# EAGLE design pcb (EAGLE 9.5.2)
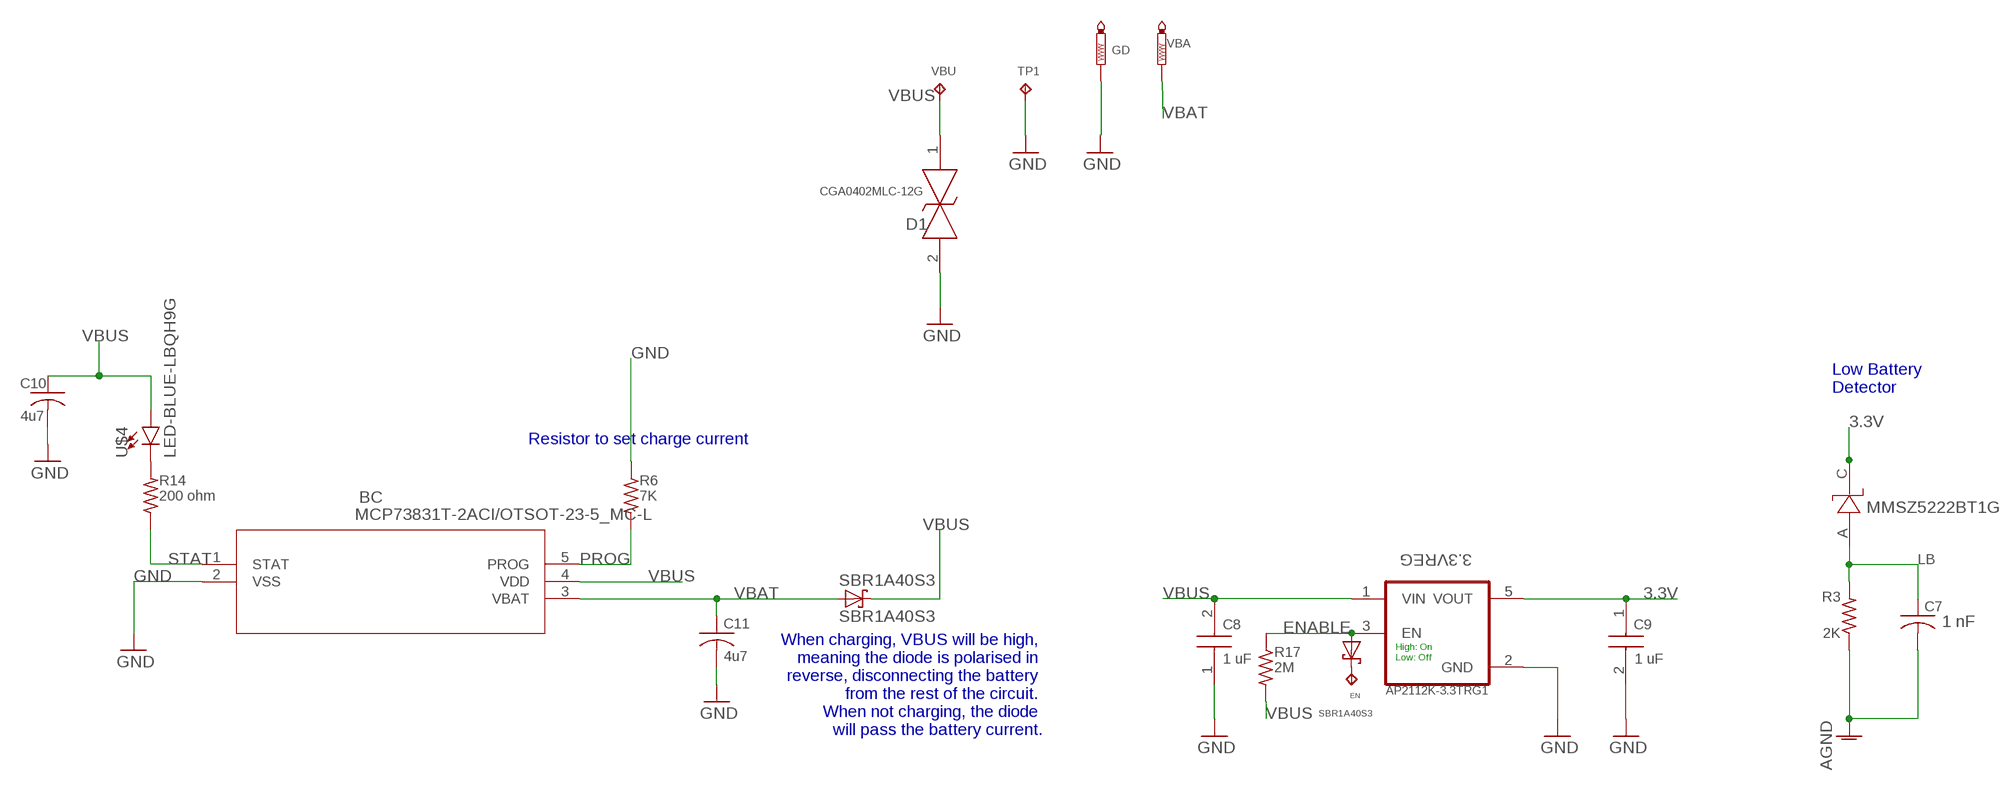
[diagram p0: schematic, sheet 1, part 1 of 2]
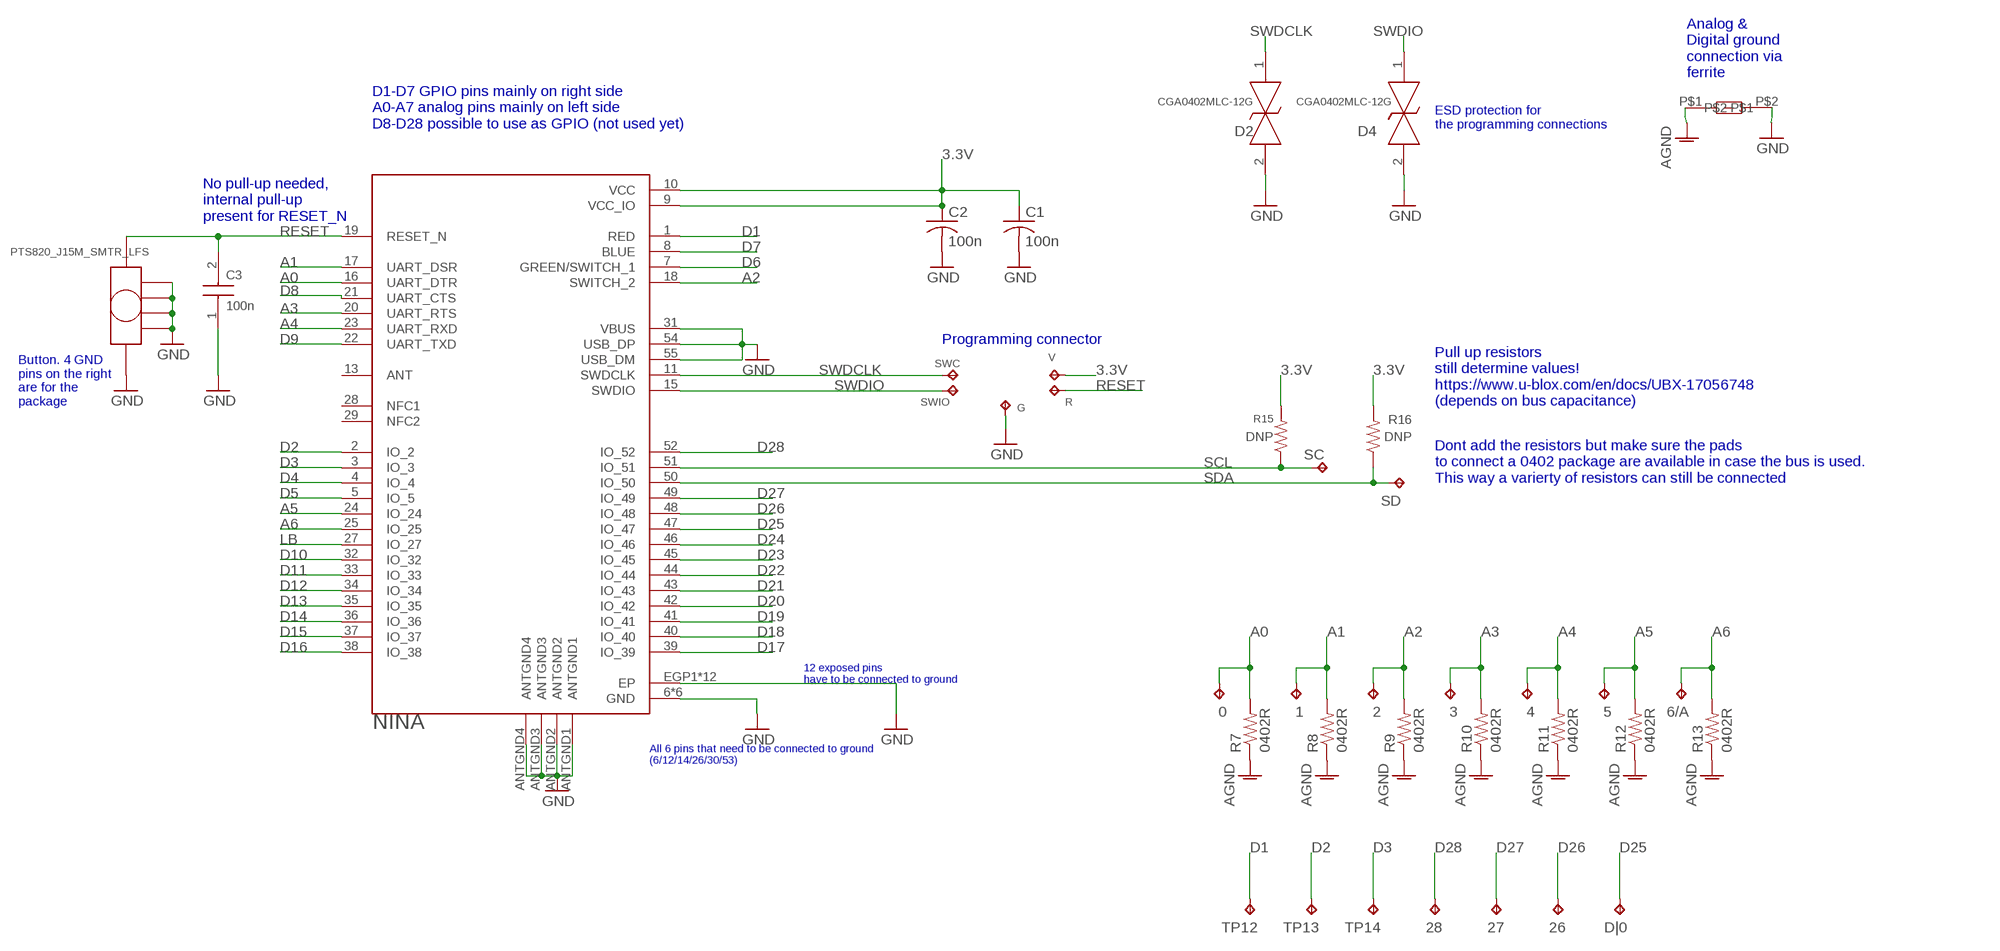
[diagram p1: schematic, sheet 1, part 2 of 2]

## Parts
0  CUSTOM_HOLE1  [CUSTOM_HOLE]
1  CUSTOM_HOLE1  [CUSTOM_HOLE]
2  CUSTOM_HOLE1  [CUSTOM_HOLE]
3  CUSTOM_HOLE1  [CUSTOM_HOLE]
3.3VREG  AP2112K-3.3TRG1  [SOT95P285X140-5N]
4  CUSTOM_HOLE1  [CUSTOM_HOLE]
5  CUSTOM_HOLE1  [CUSTOM_HOLE]
6/A  CUSTOM_HOLE1  [CUSTOM_HOLE]
26  CUSTOM_HOLE1  [CUSTOM_HOLE]
27  CUSTOM_HOLE1  [CUSTOM_HOLE]
28  CUSTOM_HOLE1  [CUSTOM_HOLE]
BC  MCP73831T-2ACI/OTSOT-23-5_MC-L  [SOT-23-5_MC-L]
BUTTON  PTS820_J15M_SMTR_LFS  [PTS820_J15]
C1  100n  C-USC0402  [C0402]
C2  100n  C-USC0402  [C0402]
C3  100n  JMK105BJ105KP-F  [CAPC1005X33N]
C7  1 nF  C-USC0402  [C0402]
C8  1 uF  JMK105BJ105KP-F  [CAPC1005X33N]
C9  1 uF  JMK105BJ105KP-F  [CAPC1005X33N]
C10  4u7  C-USC0402  [C0402]
C11  4u7  C-USC0402  [C0402]
D1  CGA0402MLC-12G  [CGA0402MLC12G]
D2  CGA0402MLC-12G  [CGA0402MLC12G]
D4  CGA0402MLC-12G  [CGA0402MLC12G]
D|0  CUSTOM_HOLE1  [CUSTOM_HOLE]
EN  CUSTOM_HOLE1  [CUSTOM_HOLE]
G  TPB1,27  [B1,27]
GD  PTR1TP18R  [TP18R]
MMSZ5222BT1G  MMSZ5222BT1G  [SOD−123]
R  TPB1,27  [B1,27]
R3  2K  0402R  [RESC1005X40N]
R6  7K  0402R  [RESC1005X40N]
R7  0402R  [RESC1005X40N]
R8  0402R  [RESC1005X40N]
R9  0402R  [RESC1005X40N]
R10  0402R  [RESC1005X40N]
R11  0402R  [RESC1005X40N]
R12  0402R  [RESC1005X40N]
R13  0402R  [RESC1005X40N]
R14  200 ohm  0402R  [RESC1005X40N]
R15  DNP  0402R  [RESC1005X40N]
R16  DNP  0402R  [RESC1005X40N]
R17  2M  0402R  [RESC1005X40N]
SBR1A40S3  SBR1A40S3  [SOD323]
SC  CUSTOM_HOLE1  [CUSTOM_HOLE]
SD  CUSTOM_HOLE1  [CUSTOM_HOLE]
SWC  TPB1,27  [B1,27]
SWIO  TPB1,27  [B1,27]
TP1  CUSTOM_HOLE1  [CUSTOM_HOLE]
TP12  CUSTOM_HOLE1  [CUSTOM_HOLE]
TP13  CUSTOM_HOLE1  [CUSTOM_HOLE]
TP14  CUSTOM_HOLE1  [CUSTOM_HOLE]
U1  NINA  NINA-B306  [XCVR_NINA-B306]
U$2  SBR1A40S3  [SOD323]
U$4  LED-BLUE-LBQH9G  [LBQH9G-0402]
U$5  BLM18KG121WH1D  [0603]
V  TPB1,27  [B1,27]
VBA  PTR1TP18R  [TP18R]
VBU  CUSTOM_HOLE1  [CUSTOM_HOLE]

## Nets
3.3V: 3.3VREG.5(VOUT) C1.1 C2.1 C9.1 MMSZ5222BT1G.C R15.2 R16.2 U1.9(VCC_IO) U1.10(VCC) V.TP
A0: 0.P$1(TP) R7.2 U1.16(UART_DTR)
A1: 1.P$1(TP) R8.2 U1.17(UART_DSR)
A2: 2.P$1(TP) R9.2 U1.18(SWITCH_2)
A3: 3.P$1(TP) R10.2 U1.20(UART_RTS)
A4: 4.P$1(TP) R11.2 U1.23(UART_RXD)
A5: 5.P$1(TP) R12.2 U1.24(IO_24)
A6: 6/A.P$1(TP) R13.2 U1.25(IO_25)
AGND: C7.2 R3.1 R7.1 R8.1 R9.1 R10.1 R11.1 R12.1 R13.1 U$5.P$1
D1: TP12.P$1(TP) U1.1(RED)
D2: TP13.P$1(TP) U1.2(IO_2)
D3: TP14.P$1(TP) U1.3(IO_3)
D4: U1.4(IO_4)
D5: U1.5(IO_5)
D6: U1.7(GREEN/SWITCH_1)
D7: U1.8(BLUE)
D8: U1.21(UART_CTS)
D9: U1.22(UART_TXD)
D10: U1.32(IO_32)
D11: U1.33(IO_33)
D12: U1.34(IO_34)
D13: U1.35(IO_35)
D14: U1.36(IO_36)
D15: U1.37(IO_37)
D16: U1.38(IO_38)
D17: U1.39(IO_39)
D18: U1.40(IO_40)
D19: U1.41(IO_41)
D20: U1.42(IO_42)
D21: U1.43(IO_43)
D22: U1.44(IO_44)
D23: U1.45(IO_45)
D24: U1.46(IO_46)
D25: D|0.P$1(TP) U1.47(IO_47)
D26: 26.P$1(TP) U1.48(IO_48)
D27: 27.P$1(TP) U1.49(IO_49)
D28: 28.P$1(TP) U1.52(IO_52)
ENABLE: 3.3VREG.3(EN) R17.1 U$2.A
GND: 3.3VREG.2(GND) BC.2(VSS) BUTTON.1 BUTTON.P$1 BUTTON.P$2 BUTTON.P$3 BUTTON.P$4 C1.2 C2.2 C3.1 C8.1 C9.2 C10.2 C11.2 D1.2 D2.2 D4.2 G.TP GD.TP R6.1 TP1.P$1(TP) U1.6(GND) U1.12(GND) U1.14(GND) U1.26(GND) U1.30(GND) U1.31(VBUS) U1.53(GND) U1.54(USB_DP) U1.55(USB_DM) U1.ANTGND1 U1.ANTGND2 U1.ANTGND3 U1.ANTGND4 U1.EGP1(EP) U1.EGP2(EP) U1.EGP3(EP) U1.EGP4(EP) U1.EGP5(EP) U1.EGP6(EP) U1.EGP7(EP) U1.EGP8(EP) U1.EGP9(EP) U1.EGP10(EP) U1.EGP11(EP) U1.EGP12(EP) U$5.P$2
LB: C7.1 MMSZ5222BT1G.A R3.2 U1.27(IO_27)
N$1: R14.2 U$4.C
N$11: EN.P$1(TP) U$2.C
PROG: BC.5(PROG) R6.2
RESET: BUTTON.2 C3.2 R.TP U1.19(RESET_N)
SCL: R15.1 SC.P$1(TP) U1.51(IO_51)
SDA: R16.1 SD.P$1(TP) U1.50(IO_50)
STAT: BC.1(STAT) R14.1
SWDCLK: D2.1 SWC.TP U1.11(SWDCLK)
SWDIO: D4.1 SWIO.TP U1.15(SWDIO)
VBAT: BC.3(VBAT) C11.1 SBR1A40S3.A VBA.TP
VBUS: 3.3VREG.1(VIN) BC.4(VDD) C8.2 C10.1 D1.1 R17.2 SBR1A40S3.C U$4.A VBU.P$1(TP)
Unconnected: U1.13(ANT) U1.28(NFC1) U1.29(NFC2)

## Notes on the sheet
- Analog & 
  Digital ground
  connection via
  ferrite
- D1-D7 GPIO pins mainly on right side
  A0-A7 analog pins mainly on left side
  D8-D28 possible to use as GPIO (not used yet)
- ESD protection for 
  the programming connections
- Low Battery
  Detector
- No pull-up needed,
  internal pull-up
  present for RESET_N
- Resistor to set charge current
- Programming connector
- Button. 4 GND
  pins on the right
  are for the
  package
- Pull up resistors
  still determine values!
  https://www.u-blox.com/en/docs/UBX-17056748
  (depends on bus capacitance)
- When charging, VBUS will be high, 
  meaning the diode is polarised in 
  reverse, disconnecting the battery 
  from the rest of the circuit. 
  When not charging, the diode 
  will pass the battery current.
- High: On
  Low: Off
- Dont add the resistors but make sure the pads 
  to connect a 0402 package are available in case the bus is used. 
  This way a varierty of resistors can still be connected
- 12 exposed pins 
  have to be connected to ground
- All 6 pins that need to be connected to ground
  (6/12/14/26/30/53)

## Library data of the parts
0 1-5 6/A 26-28 D|0 EN SC SD TP1 TP12-TP14 VBU = testpad:CUSTOM_HOLE1
3.3VREG = AP2112K-3.3TRG1:AP2112K-3.3TRG1: AP2112 Series 0.6 A 3.3 V Fixed Output SMT LDO Linear Regulator - SOT23-5; AVAILABILITY: Unavailable; DESCRIPTION: Linear Voltage Regulator IC 1 Output 600mA SOT-25; MF: Diodes Inc.; MP: AP2112K-3.3TRG1; PACKAGE: SOT-753 Diodes Inc.; PRICE: None
BC = MCP73831T-2ACI-OT_BattCharg:MCP73831T-2ACI/OT; BUILT_BY: EMA_UL_Team; MANUFACTURER_PART_NUMBER: MCP73831T-2ACI/OT; VENDOR: Microchip
BUTTON = [button]PTS820_J15M_SMTR_LFS:PTS820_J15M_SMTR_LFS: PTS 820 Series Microminiature SMT Top Actuated Source: Datasheet <http://www.ckswitches.com/media/1474/pts820.pdf>; DESCRIPTION: PTS 820 Series Microminiature SMT Top Actuated; HEIGHT: mm; MANUFACTURER_NAME: C & K COMPONENTS; MANUFACTURER_PART_NUMBER: PTS820 J15M SMTR LFS; MOUSER_PART_NUMBER: 611-PTS820J15MSMTR; MOUSER_PRICE-STOCK: https://www.mouser.com/Search/Refine.aspx?Keyword=611-PTS820J15MSMTR; RS_PART_NUMBER: 1359503P; RS_PRICE-STOCK: http://uk.rs-online.com/web/p/products/1359503P
C1 C2 C7 C10 C11 = rcl:C-US: CAPACITOR, American symbol; SPICEPREFIX: C
C3 C8 C9 = capacitor_1uF_0402:JMK105BJ105KP-F: Taiyo Yuden JMK105BJ105KP-F 1F MLCC 6.3V dc +/-10% Tolerance SMD Source: Datasheet <https://componentsearchengine.com/Datasheets/1/JMK105BJ105KP-F.pdf>; DESCRIPTION: Taiyo Yuden JMK105BJ105KP-F 1F MLCC 6.3V dc +/-10% Tolerance SMD; HEIGHT: 0.33mm; MANUFACTURER_NAME: TAIYO YUDEN; MANUFACTURER_PART_NUMBER: JMK105BJ105KP-F; MOUSER_PART_NUMBER: 963-JMK105BJ105KP-F; MOUSER_PRICE-STOCK: https://www.mouser.com/Search/Refine.aspx?Keyword=963-JMK105BJ105KP-F
D1 D2 D4 = CGA0402MLC-12G:CGA0402MLC-12G: Bourns CGA0402MLC-12G, ESD Protection Diode, 2-Pin MLC Source: Datasheet <https://componentsearchengine.com/Datasheets/1/CGA0402MLC-12G.pdf>; DESCRIPTION: Bourns CGA0402MLC-12G, ESD Protection Diode, 2-Pin MLC; HEIGHT: 0.44mm; MANUFACTURER_NAME: Bourns; MANUFACTURER_PART_NUMBER: CGA0402MLC-12G; MOUSER_PART_NUMBER: 652-CGA0402MLC-12G; MOUSER_PRICE-STOCK: https://www.mouser.com/Search/Refine.aspx?Keyword=652-CGA0402MLC-12G
G R SWC SWIO V = testpad:TP: Test pad
GD VBA = testpad:PTR1: TEST PIN
MMSZ5222BT1G = [Zener]MMSZ52xxxT1G:MMSZ5222BT1G
R3 R6-R17 = custom0402R:0402R
SBR1A40S3 U$2 = diode:SBR1A40S3
U1 = NINA-B306:NINA-B306: BLUETOOTH LOW ENERGY MODULE STAN; AVAILABILITY: Unavailable; DESCRIPTION: Bluetooth Bluetooth v5.0 Transceiver Module 2.4GHz Antenna Not Included Surface Mount; MF: U-Blox America Inc.; MP: NINA-B311-00B; PACKAGE: SMD-55 U-Blox America Inc.; PRICE: None
U$4 = SparkFun-LED:LED-BLUE-LBQH9G
U$5 = [Ferrite]:BLM18KG121WH1D

## Board
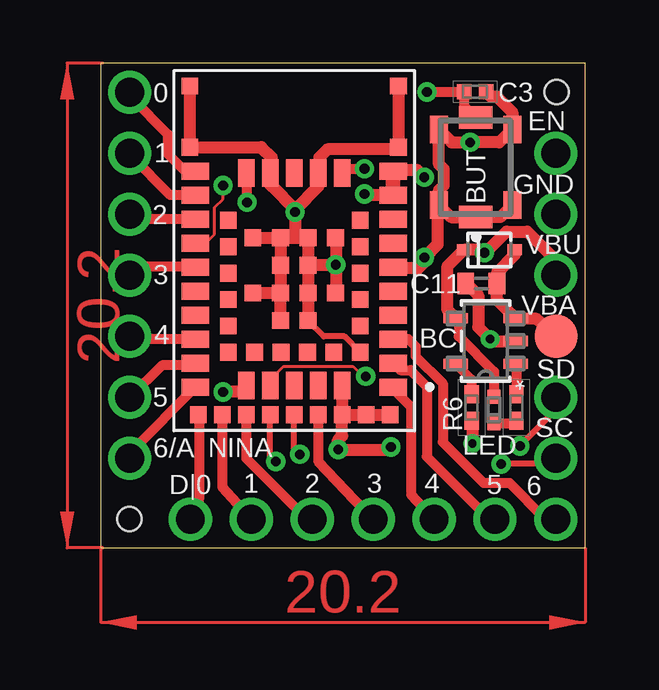
[diagram p2: board, top side]
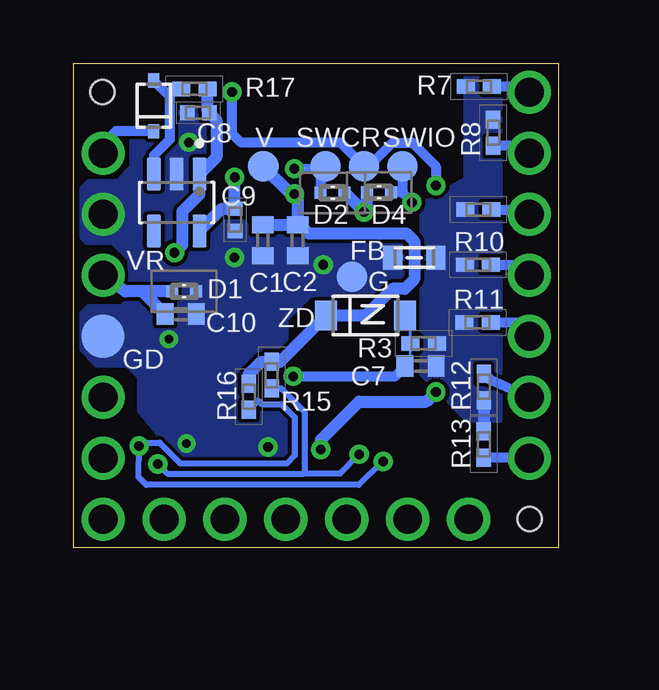
[diagram p3: board, bottom side, seen from below]

Size 20.2 x 20.2 mm. Coordinates in mm from the lower left corner, seen from the top.
Outline: 0,0 20.2,0 20.2,20.2 0,20.2 0,0
Copper layers (1*16): Top 0.035mm / dielectric 1.5mm / Bottom 0.035mm
Design rules "default *": minimum track width 3mil, minimum drill 0.35mm, track to track 6mil, track to pad 6mil, pad to pad 6mil, via to via 6mil, smd to smd 6mil, copper to edge 10mil, drill to drill 0.4mm, minimum pad ring 10mil, minimum via ring 8mil, stop-mask expansion 4mil, vias tented up to drill 0mil, thermal gap 0mil
Holes 1 mm at 1.2,1.2 19,19

### Footprints (pad centres in the part's own frame; a part is rotated, then mirrored left to right if it is on the bottom)
CUSTOM_HOLE = drill 1.2: P$1 0,0
SOT95P285X140-5N = smd 1.35 x 0.6: 1 -1.185,0.95; 2 -1.185,0; 3 -1.185,-0.95; 4 1.185,-0.95; 5 1.185,0.95
SOT-23-5_MC-L = smd 1.01 x 0.428: 1 -1.245,0.95; 2 -1.245,0; 3 -1.245,-0.95; 4 1.245,-0.95; 5 1.245,0.95
PTS820_J15 = smd 0.95 x 1.4: 1 -2.075,0; 2 2.075,0 | smd 1.15 x 0.75: P$1 -1.575,1.525; P$2 1.575,1.525; P$3 1.575,-1.525; P$4 -1.575,-1.525
C0402 = smd 0.7 x 0.9: 1 -0.65,0; 2 0.65,0
CAPC1005X33N = smd 0.6 x 0.62: 1 -0.46,0; 2 0.46,0
CGA0402MLC12G = smd 0.5 x 0.5: 1 -0.5,0; 2 0.5,0
B1,27 = smd 1.27 x 1.27: TP 0,0
TP18R = smd 1.8 x 1.8: TP 0,0
SOD−123 = smd 0.91 x 1.22: A 3.28,0; C 0,0
RESC1005X40N = smd 0.75 x 0.6: 1 -0.55,0; 2 0.55,0
SOD323 = smd 0.59 x 0.45: A 2.405,0; C 0.295,0
XCVR_NINA-B306 = smd 1.15 x 0.7: 1 -4.125,4; 2 -4.125,3; 3 -4.125,2; 4 -4.125,1; 5 -4.125,0; 6 -4.125,-1; 7 -4.125,-2; 8 -4.125,-3; 9 -4.125,-4; 10 -4.125,-5; 16 4.125,-5; 17 4.125,-4; 18 4.125,-3; 19 4.125,-2; 20 4.125,-1; 21 4.125,0; 22 4.125,1; 23 4.125,2; 24 4.125,3; 25 4.125,4 | smd 0.7 x 1.15: 11 -2,-4.925; 12 -1,-4.925; 13 0,-4.925; 14 1,-4.925; 15 2,-4.925; 26 2,3.925; 27 1,3.925; 28 0,3.925; 29 -1,3.925; 30 -2,3.925 | smd 0.7 x 0.7: 31 -2.75,2.55; 32 -2.75,1.45; 33 -2.75,0.35; 34 -2.75,-0.75; 35 -2.75,-1.85; 36 -2.75,-2.95; 37 2.75,-2.95; 38 2.75,-1.85; 39 2.75,-0.75; 40 2.75,0.35; 41 2.75,1.45; 42 2.75,2.55; 43 1.65,2.55; 44 0.55,2.55; 45 -0.55,2.55; 46 -1.65,2.55; 47 4,5.15; 48 3,5.15; 49 2,5.15; 50 1,5.15; 51 0,5.15; 52 -1,5.15; 53 -2,5.15; 54 -3,5.15; 55 -4,5.15; ANTGND1 -4.35,-6; ANTGND2 -4.35,-8.55; ANTGND3 4.35,-6; ANTGND4 4.35,-8.55; EGP1 -0.575,1.225; EGP2 0.575,1.225; EGP3 -1.725,0.075; EGP4 -0.575,0.075; EGP5 0.575,0.075; EGP6 1.725,0.075; EGP7 -0.575,-1.075; EGP8 0.575,-1.075; EGP9 -1.725,-2.225; EGP10 -0.575,-2.225; EGP11 0.575,-2.225; EGP12 1.725,-2.225
LBQH9G-0402 = smd 0.6 x 0.55: A 0.55,0; C -0.55,0
0603 = smd 0.8 x 1: P$1 -0.9,0; P$2 0.9,0

### Placement (x,y rotation side)
0  1.2,18.98 0 top
1  1.2,16.44 0 top
2  1.2,13.9 0 top
3  1.2,11.36 0 top
3.3VREG  15.91,14.39 270 bottom
4  1.2,8.82 0 top
5  1.2,6.28 0 top
6/A  1.2,3.74 0 top
26  6.28,1.2 90 top
27  8.82,1.2 90 top
28  11.36,1.2 90 top
BC  16.05,8.62 180 top
BUTTON  15.63,15.86 90 top
C1  12.32,12.82 270 bottom
C2  10.87,12.82 270 bottom
C3  15.61,19 180 top
C7  5.74,7.58 0 bottom
C8  15.01,18.13 0 bottom
C9  13.48,13.67 270 bottom
C10  15.74,9.74 0 bottom
C11  15.87,11.02 180 top
D1  15.6,10.69 0 bottom
D2  9.41,14.79 0 bottom
D4  7.47,14.81 180 bottom
D|0  3.74,1.2 90 top
EN  18.98,16.44 90 top
G  8.6,11.3 0 bottom
GD  18.98,8.82 0 bottom
MMSZ5222BT1G  9.68,9.68 0 bottom
R  8.1,15.9 0 bottom
R3  5.62,8.52 180 bottom
R6  15.46,5.85 90 top
R7  3.31,19.22 0 bottom
R8  2.71,17.3 270 bottom
R9  3.33,14.1 0 bottom
R10  3.35,11.8 0 bottom
R11  3.37,9.4 0 bottom
R12  3.1,6.71 90 bottom
R13  3.11,4.31 270 bottom
R14  17.33,5.85 270 top
R15  11.95,7.2 90 bottom
R16  12.9,6.3 90 bottom
R17  15.17,19.13 0 bottom
SBR1A40S3  14.85,12.42 0 top
SC  18.98,3.74 270 top
SD  18.98,6.28 270 top
SWC  9.7,15.9 0 bottom
SWIO  6.5,15.9 0 bottom
TP1  18.98,13.9 0 bottom
TP12  13.9,1.2 90 top
TP13  16.44,1.2 90 top
TP14  18.98,1.2 90 top
U1  8.07,10.7 180 top
U$2  16.87,17.07 90 bottom
U$4  16.4,5.75 90 top
U$5  6,12.1 180 bottom
V  12.3,15.9 0 bottom
VBA  18.98,8.82 90 top
VBU  18.98,11.36 180 top

### Tracks (layer width: path | path; a pad name or v marks a point on that pad's centre or on a via)
3.3V  (via drill 0.4)
  Top 0.152: U1.10 12.24,15.74
  Top 0.508: v13.49,15.45 13.2,15.74 12.24,15.74 | U1.9 11.05,14.7 v11,14.75
  Top 0.61: U1.10 U1.9
  Bottom 0.152: C9.1 13.49,14.14
  Bottom 0.508: R16.2 12.9,7.25 12.4,7.75 R15.2 11.61,7.75 MMSZ5222BT1G.C 8.04,9.68 6.92,10.8 6.4,10.8 6,11.2 6,12.78 6.33,13.11 10.41,13.11 10.77,13.47 C2.1 | C1.1 C2.1 | 3.3VREG.5 14.04,14.13 C9.1 | 13.49,14.14 v13.49,15.45 | V.TP 11.15,14.75 v11,14.75 10.87,14.62 C2.1
A0
  Top 0.406: 0.P$1 1.3,18.74 2.81,17.23 2.81,16.39 3.51,15.7 U1.16
  Bottom 0.406: R7.2 2.74,19.24 1.5,19.24 0.P$1
A1
  Top 0.406: U1.17 2.9,14.7 1.3,16.3 1.P$1
  Bottom 0.406: 1.P$1 1.41,16.75 R8.2
A2
  Top 0.406: U1.18 3.94,13.69 1.57,13.69 2.P$1
  Bottom 0.406: R9.2 1.42,14.1 2.P$1
A3
  Top 0.406: U1.20 3.94,11.71 1.37,11.71 1.3,11.52 3.P$1
  Bottom 0.406: R10.2 1.32,11.8 3.P$1
A4
  Top 0.406: U1.23 1.48,8.7 4.P$1
  Bottom 0.406: R11.2 1.32,9.4 4.P$1
A5
  Top 0.406: U1.24 3.85,7.61 2.57,7.61 5.P$1
  Bottom 0.406: R12.2 2.86,7.02 5.P$1
A6
  Top 0.406: U1.25 1.3,4.05 6/A.P$1
  Bottom 0.406: 6/A.P$1 2.16,3.76 R13.2
AGND
  Bottom 0.152: R12.1
  Bottom 0.508: R12.1 R13.1
  pour Bottom: 3.9,19.6 3.9,15.38 5.7,14.35 5.7,7.2 3.8,5.3 2.4,5.3 2.4,19.6
D1
  Top 0.152: 12.94,2.37 12.94,2.23
  Top 0.406: U1.1 12.2,6.63 12.94,5.88 12.94,2.37 | 12.94,2.23 TP12.P$1
D2
  Top 0.406: U1.2 12.49,7.41 12.92,7.41 13.6,6.72 13.6,3.8 16.14,1.26 TP13.P$1
D3
  Top 0.406: U1.3 12.82,8.7 13.13,8.4 13.13,7.99 14.26,6.85 14.26,4.4 15.96,2.71 17.04,2.71 18.49,1.26 TP14.P$1
D25
  Top 0.152: U1.47 4.1,5.52
  Top 0.406: 4.1,5.52 4.1,2.03 D|0.P$1
D26
  Top 0.406: U1.48 5.07,2.54 26.P$1
D27
  Top 0.406: U1.49 6.07,3.73 8.54,1.26 27.P$1
D28
  Top 0.406: U1.52 9.07,3.62 28.P$1
ENABLE
  Bottom 0.406: 3.3VREG.3 16.86,16.35 16.19,17.02 16.19,18.99 | U$2.A 16.29,18.89 16.19,18.99 | R17.1 16.05,19.13 16.19,18.99
GND  (via drill 0.35, 0.4)
  Top 0.15: U1.31
  Top 0.152: 7.5,11.7 U1.EGP8 | U1.EGP1 8.61,9.51 | U1.EGP5 7.5,10.6 7.47,10.62 | v9.79,11.79 v9.8,11.8 | U1.EGP7 8.66,11.79 | 15.52,10.72 C11.2 | U1.26 5.79,6.5
  Top 0.254: 8.61,9.51 9.3,8.82 10.16,8.82 U1.31
  Top 0.508: U1.EGP11 U1.EGP8 U1.EGP5 | U1.30 U1.53 | U1.53 U1.54 U1.55 | U1.EGP1 U1.EGP4 U1.EGP7 U1.EGP10 8.1,12.93 | U1.EGP2 7.5,10.6 | 8.66,11.79 v9.79,11.79 | U1.EGP9 v9.8,11.8 U1.EGP3 | U1.ANTGND2 U1.ANTGND1 12.33,16.61 9.46,16.61 9.11,16.27 9.11,15.67 U1.12 9.07,15.06 8.1,14.1 | U1.EGP12 U1.EGP11 | U1.EGP6 7.47,10.62 | U1.ANTGND4 U1.ANTGND3 6.7,16.7 7.13,16.27 7.13,15.68 U1.14 7.07,15.12 7.11,15.08 8.1,14.1 | 5.79,6.5 v5.1,6.5 | BUTTON.P$1 14.61,13.79 BUTTON.1 16.66,13.79 BUTTON.P$4 | BUTTON.P$1 14.04,14.22 14.04,12.64 v13.5,12.1 13.5,11.9 13.24,11.64 12.25,11.64 U1.6 | U1.EGP11 8.1,12.93 | 8.1,14.1 v8.1,14 8.1,12.93 | v12.1,4.2 12,4.1 v9.9,4.1 9.9,4.5 10.07,4.67 U1.53 | v16.24,8.7 16.32,8.62 BC.2 | C11.2 15.24,11.02 15.74,10.53 15.74,9.2 v16.24,8.7 | v16.24,8.7 16.3,8.64 | BUTTON.P$1 14.11,14.91 14.3,15.11 14.3,15.78 14.11,15.98 BUTTON.P$2 14.64,16.9 v15.4,16.9 16.62,16.9 BUTTON.P$3 17.16,18.16 16.5,18.82 16.25,18.82 C3.1 | R6.1 15.5,5.24 v15.5,4.35
  Bottom 0.152: C1.2 12.31,12.07 | C2.2 10.55,12.17
  Bottom 0.508: v5.1,6.5 5.5,6.1 8.3,6.1 9.9,4.5 v9.9,4.1 | D4.2 7.97,14.13 v8.1,14 8.89,14.79 D2.2
  pour Bottom: 13.35,13.85 12.9,13.4 6.9,13.4 6.3,12.8 6.3,11.3 7.1,10.5 10.3,10.5 11.3,9.5 11.3,4 12,3.3 15.55,3.3 17.5,5.7 17.5,7.1 18,7.6 19.27,7.6 20,8.33 20,9.7 19.6,10.1 18.2,10.1 17.9,10.4 17.9,12 18.6,12.7 19.7,12.7 20.2,13.3 20.2,14.7 19.6,15.3 18.4,15.3 17.8,15.9 17.8,18.3 13.25,18.3
LB  (via drill 0.4)
  Top 0.127: v11.05,7.15 10.93,7.15 10.51,7.57 7.63,7.57 7.07,7 U1.27
  Bottom 0.127: C7.1 6.17,7.8 R3.2 6.17,9.37 6.4,9.6
  Bottom 0.152: 6.4,9.6 MMSZ5222BT1G.A
  Bottom 0.406: v11.05,7.15 6.82,7.15 C7.1
N$1
  Top 0.406: U$4.C 17.38,5.2 17.33,5.25 R14.2
N$11
  Bottom 0.406: U$2.C 18.45,17.36 18.9,16.92 EN.P$1
PROG
  Top 0.406: BC.5 15.46,7.01 R6.2
RESET  (via drill 0.4)
  Top 0.127: U1.19 3.98,12.73 4.42,12.73 4.75,13.08 4.75,14.19 5.1,14.54 v5.1,15.1
  Top 0.406: v13.6,19 C3.2 15.15,18.41 BUTTON.2
  Bottom 0.406: v13.6,19 13.6,17.26 13.23,16.89 9.09,16.89 R.TP 7.9,15.9 6.91,16.89 6.09,16.89 5.11,15.91 v5.11,15.11 v5.1,15.1
SCL  (via drill 0.4)
  Top 0.254: SC.P$1 18.57,3.5 v16.7,3.5 | v8.3,3.9 8.07,4.13 U1.51
  Bottom 0.254: v8.3,3.9 9.1,3.1 10.6,3.1 | R15.1 11.55,6.65 10.58,5.68 10.58,3.12 10.6,3.1 | v16.7,3.5 16.3,3.1 10.6,3.1
SDA  (via drill 0.4)
  Top 0.254: v7.3,3.6 7.07,3.83 U1.50 | v17.48,4.25 18.9,5.67 SD.P$1
  Bottom 0.254: R16.1 12.52,6.13 12.52,6.15 12.37,6 11.54,6 10.99,5.45 10.99,3.85 11.32,3.52 15.75,3.52 16.62,4.38 17.37,4.38 v17.48,4.25 17.5,2.95 17.18,2.63 8.32,2.63 7.33,3.6 v7.3,3.6
STAT
  Top 0.152: BC.1 17.33,7.63
  Top 0.406: 17.33,7.63 R14.1
SWDCLK  (via drill 0.4)
  Top 0.406: U1.11 10.24,15.8 v11,15.8
  Bottom 0.152: SWC.TP 9.75,15.85
  Bottom 0.406: v11,15.8 9.8,15.8 9.75,15.85 | SWC.TP 9.91,15.69 D2.1
SWDIO  (via drill 0.4)
  Top 0.406: v6.1,14.4 6.1,15.6 U1.15
  Bottom 0.406: D4.1 6.51,14.81 v6.1,14.4 6.5,14.8 SWIO.TP
VBAT
  Top 0.508: SBR1A40S3.A 17.25,12.21 16.52,11.47 C11.1 16.52,10.35 BC.3 17.32,9.54 18.17,9.54 VBA.TP
VBUS  (via drill 0.4)
  Top 0.406: BC.4 14.93,9.44 14.93,8.81 16.4,7.34 U$4.A
  Top 0.508: BC.4 14.46,9.91 14.46,11.74 SBR1A40S3.C 15.88,12.42 v16,12.3 16.04,12.3 16.92,13.18 17.79,13.18 18.9,12.07 VBU.P$1
  Bottom 0.508: v16,12.3 15.67,12.63 15.67,14.02 14.96,14.73 3.3VREG.1 14.25,16.29 14.25,17.83 C8.2 14.62,18.2 R17.2 | D1.1 17.34,10.69 | VBU.P$1 18.05,10.69 17.34,10.69 | C10.1 17.34,10.69
(copper drawn outside any net)
  shapes: Top area x2

### Text on the board
tNames: 1 | 2 | 3 | 4 | 5 | 6
bNames: FB | VR | ZD | C10